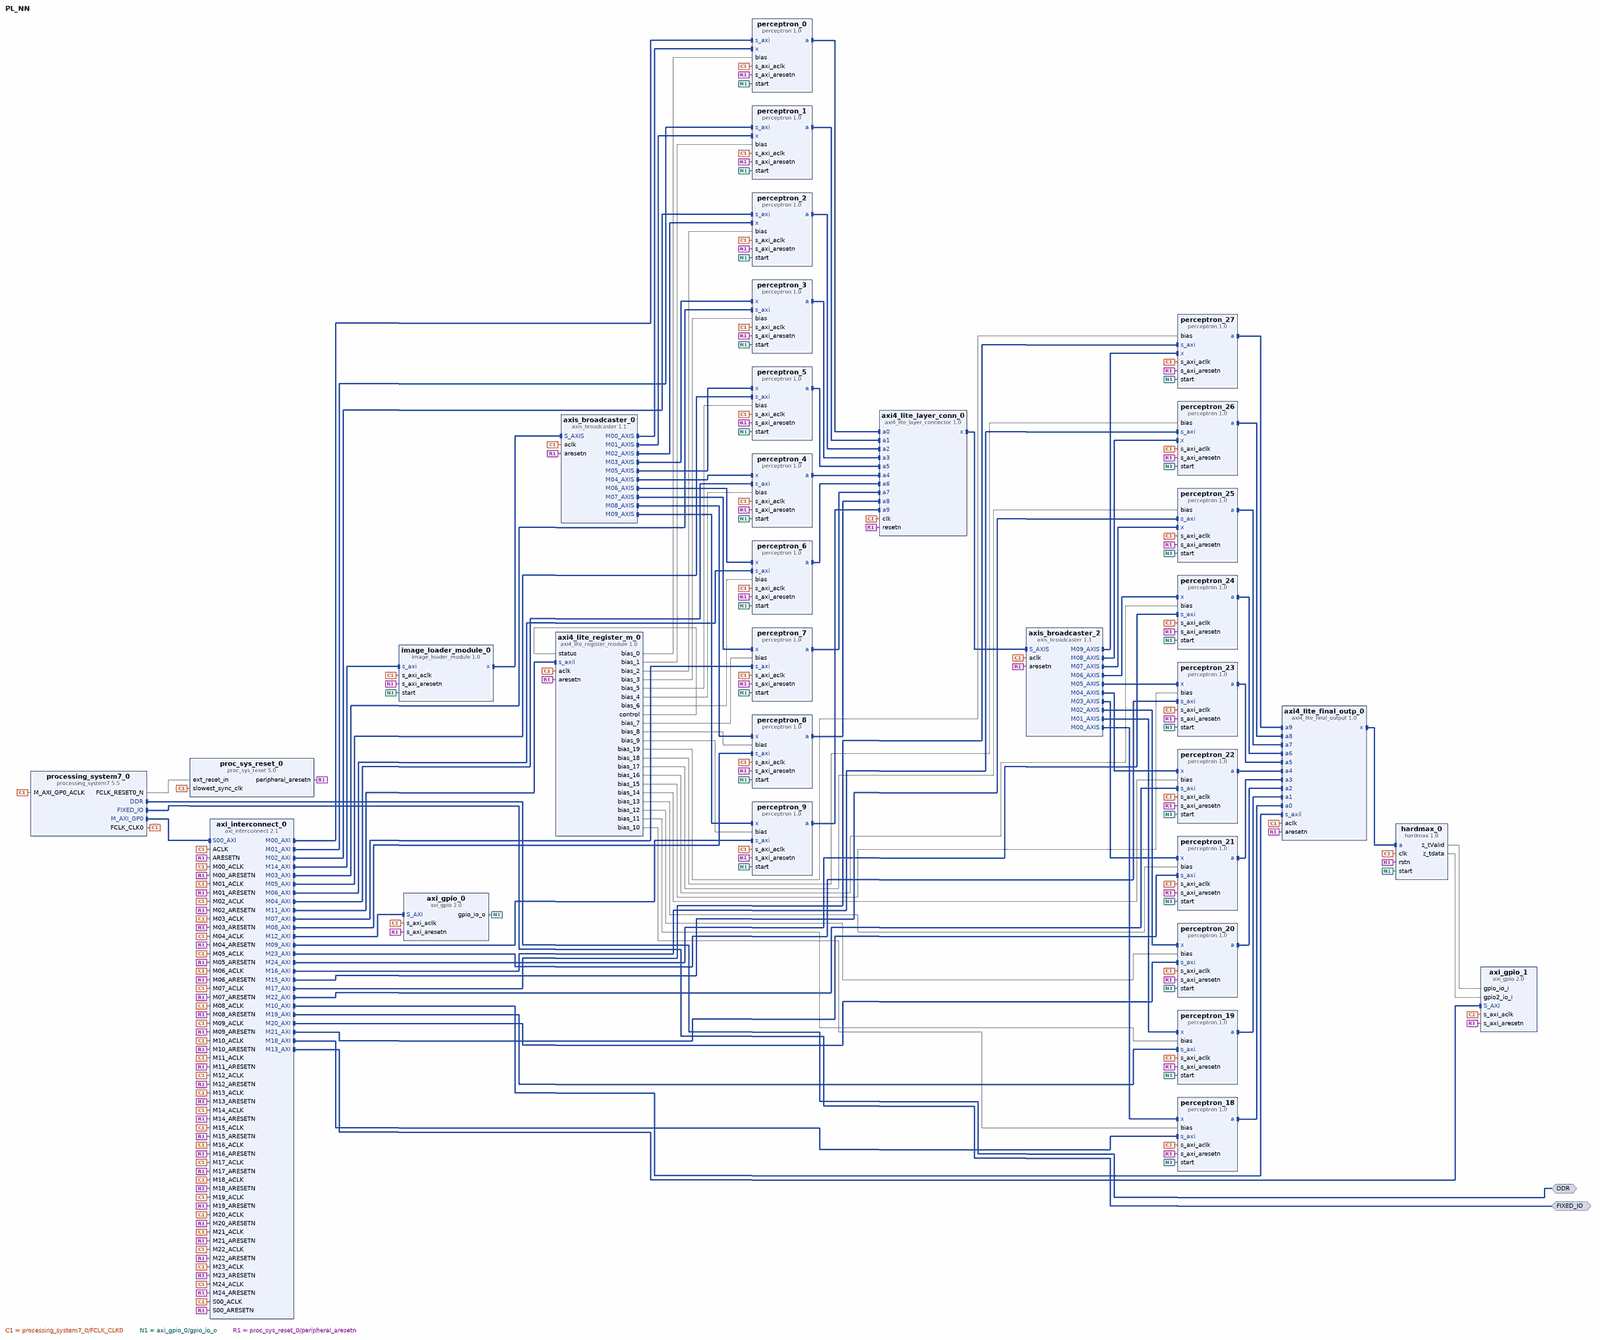
[diagram p0: block diagram of the top level, whole]
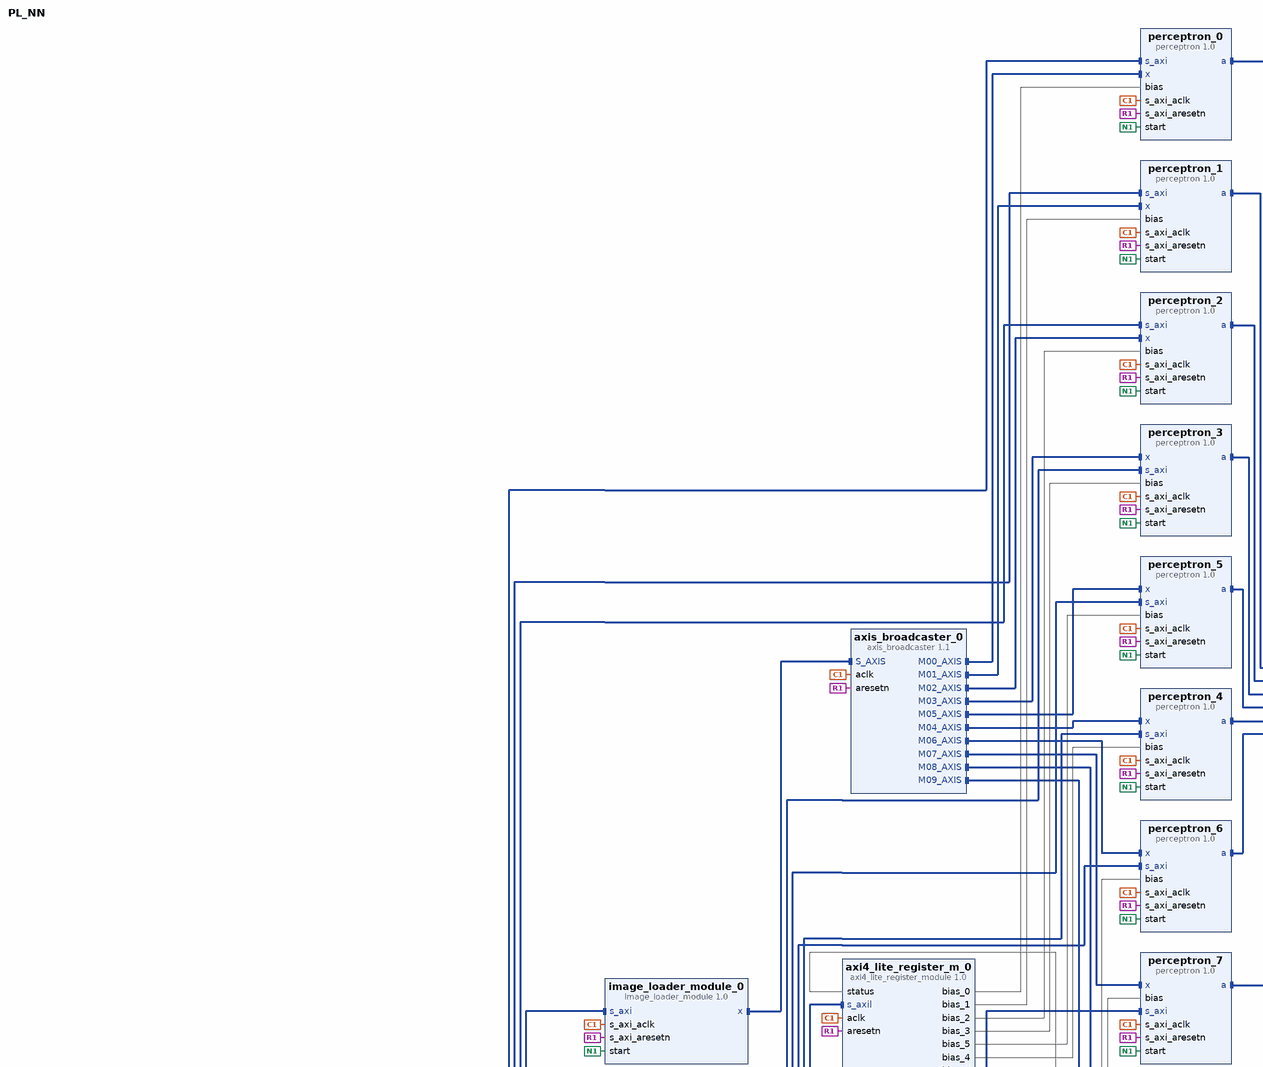
[diagram p1: block diagram of the top level, upper left part]
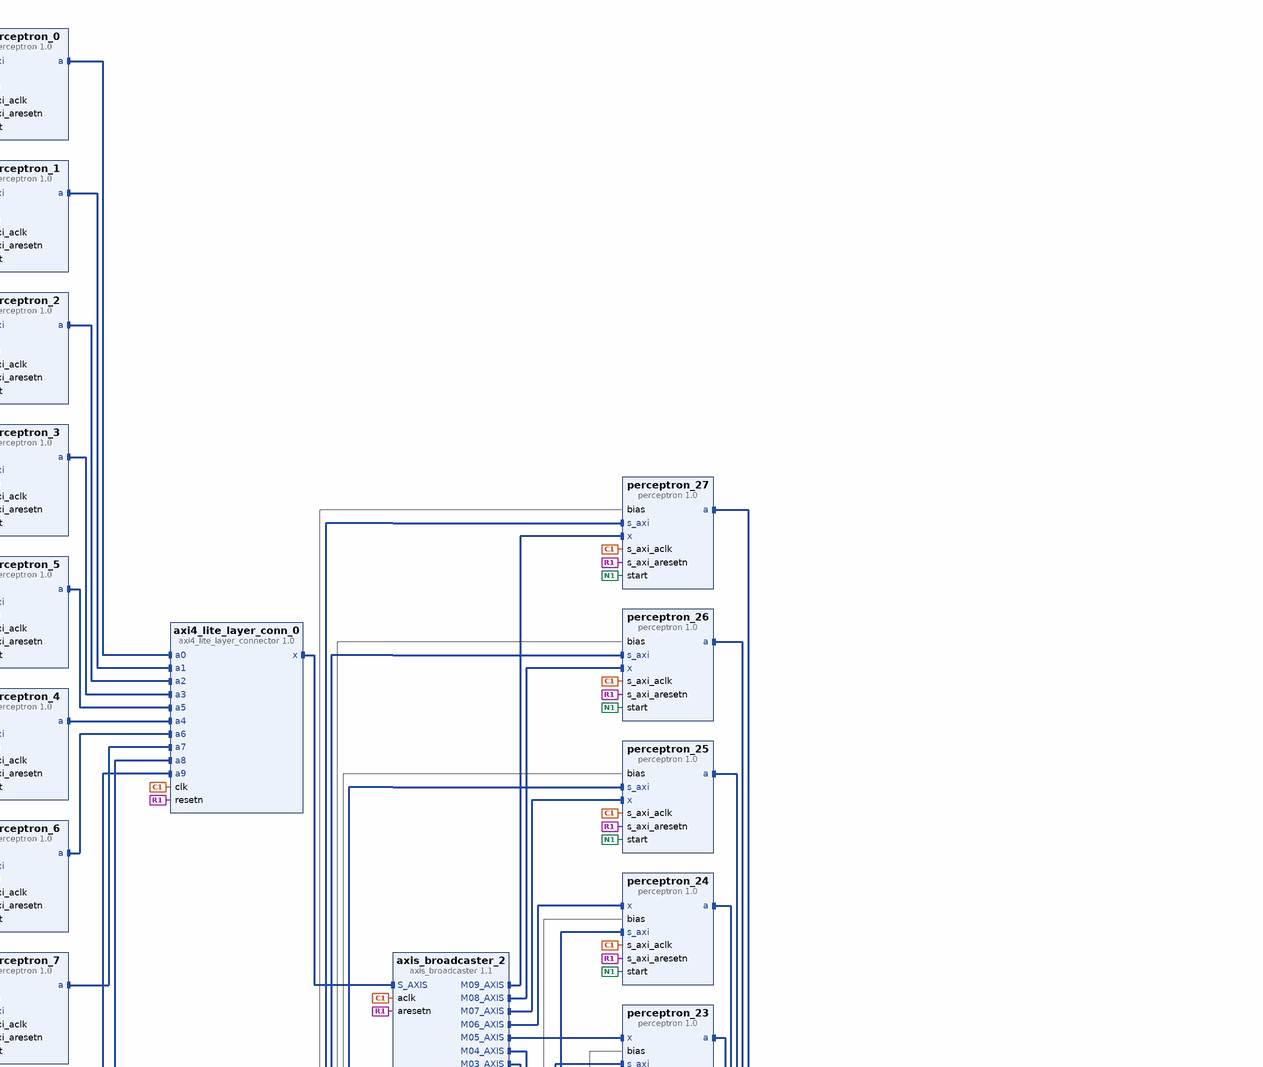
[diagram p2: block diagram of the top level, upper right part]
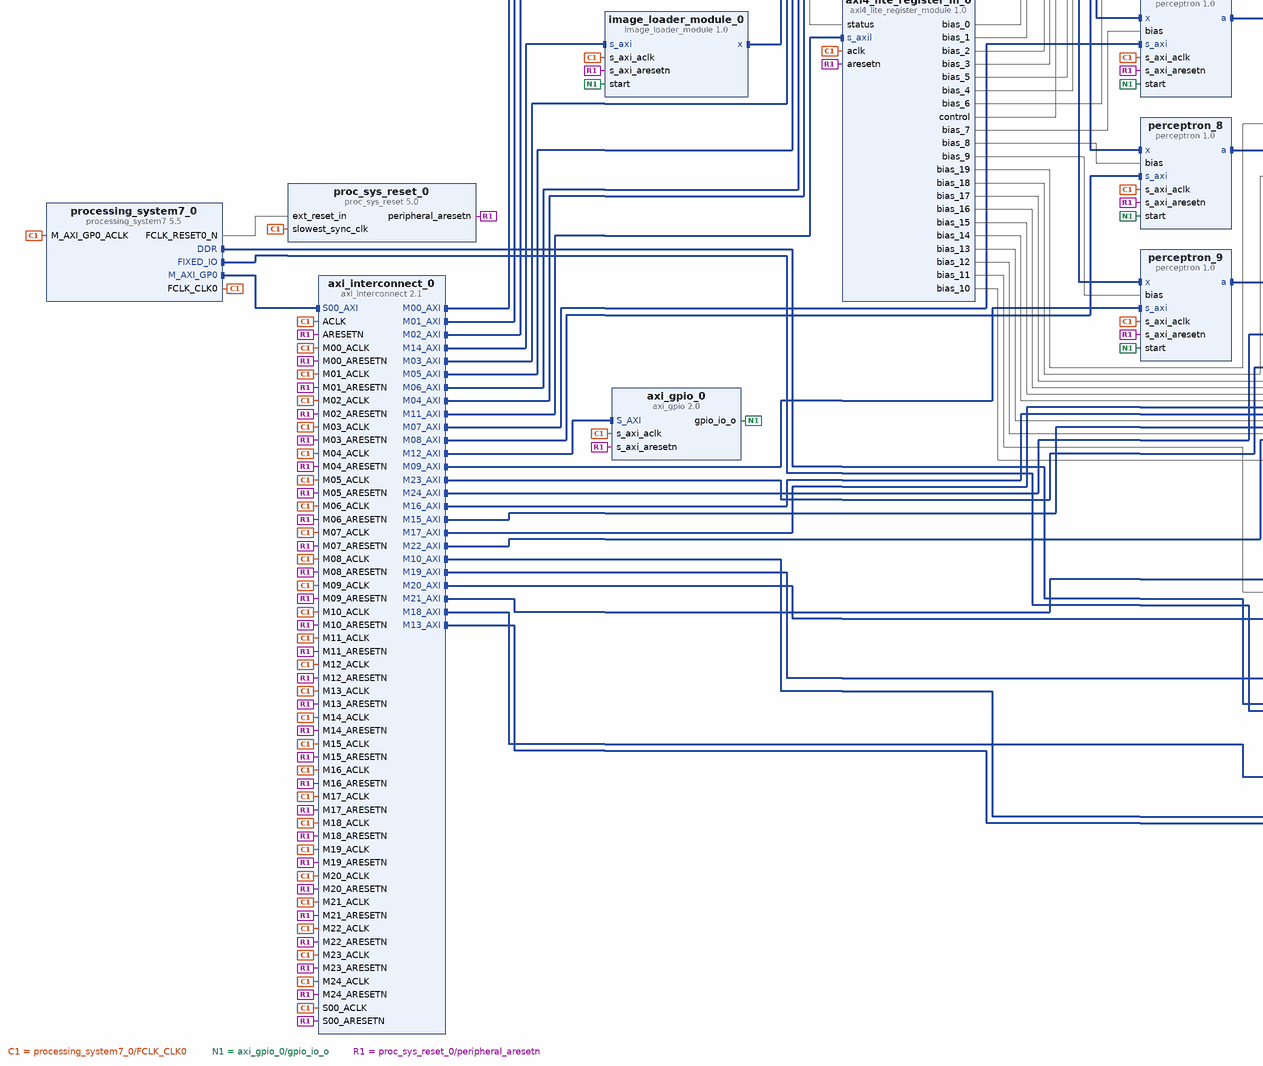
[diagram p3: block diagram of the top level, lower left part]
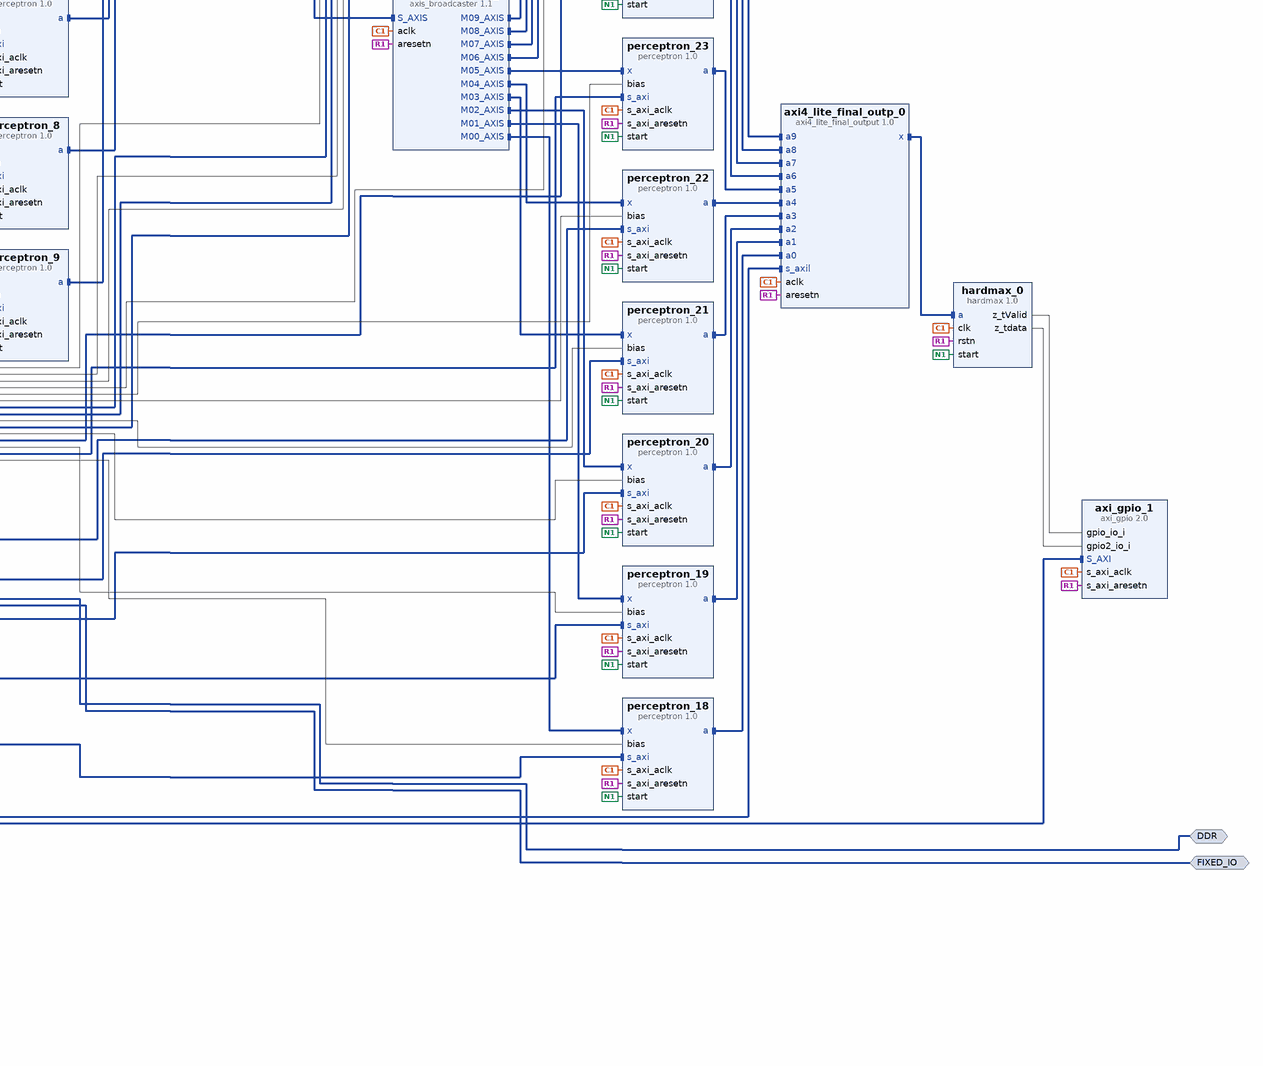
[diagram p4: block diagram of the top level, lower right part]
# Vivado block design PL_NN, xc7z010clg400-1, Vivado 2019.2
create_bd_design PL_NN

create_bd_intf_port -mode Master -vlnv xilinx.com:interface:ddrx_rtl:1.0 DDR
create_bd_intf_port -mode Master -vlnv xilinx.com:display_processing_system7:fixedio_rtl:1.0 FIXED_IO

create_bd_cell -type ip -vlnv xilinx.com:ip:processing_system7:5.5 processing_system7_0
set_property -dict [list \
  CONFIG.PCW_APU_PERIPHERAL_FREQMHZ 650 \
  CONFIG.PCW_CRYSTAL_PERIPHERAL_FREQMHZ 50.000000 \
  CONFIG.PCW_ENET0_ENET0_IO {MIO 16 .. 27} \
  CONFIG.PCW_ENET0_GRP_MDIO_ENABLE 1 \
  CONFIG.PCW_ENET0_GRP_MDIO_IO {MIO 52 .. 53} \
  CONFIG.PCW_ENET0_PERIPHERAL_ENABLE 1 \
  CONFIG.PCW_ENET0_RESET_ENABLE 0 \
  CONFIG.PCW_ENET_RESET_ENABLE 1 \
  CONFIG.PCW_ENET_RESET_SELECT {Share reset pin} \
  CONFIG.PCW_FPGA0_PERIPHERAL_FREQMHZ 75 \
  CONFIG.PCW_FPGA1_PERIPHERAL_FREQMHZ 50 \
  CONFIG.PCW_GP0_EN_MODIFIABLE_TXN 0 \
  CONFIG.PCW_GP1_EN_MODIFIABLE_TXN 0 \
  CONFIG.PCW_GPIO_MIO_GPIO_ENABLE 1 \
  CONFIG.PCW_GPIO_MIO_GPIO_IO MIO \
  CONFIG.PCW_I2C_RESET_ENABLE 1 \
  CONFIG.PCW_PERIPHERAL_BOARD_PRESET part0 \
  CONFIG.PCW_PRESET_BANK1_VOLTAGE {LVCMOS 1.8V} \
  CONFIG.PCW_QSPI_GRP_FBCLK_ENABLE 1 \
  CONFIG.PCW_QSPI_GRP_FBCLK_IO {MIO 8} \
  CONFIG.PCW_QSPI_GRP_SINGLE_SS_ENABLE 1 \
  CONFIG.PCW_QSPI_GRP_SINGLE_SS_IO {MIO 1 .. 6} \
  CONFIG.PCW_QSPI_PERIPHERAL_ENABLE 1 \
  CONFIG.PCW_QSPI_QSPI_IO {MIO 1 .. 6} \
  CONFIG.PCW_SD0_GRP_CD_ENABLE 1 \
  CONFIG.PCW_SD0_GRP_CD_IO {MIO 47} \
  CONFIG.PCW_SD0_GRP_WP_ENABLE 1 \
  CONFIG.PCW_SD0_GRP_WP_IO EMIO \
  CONFIG.PCW_SD0_PERIPHERAL_ENABLE 1 \
  CONFIG.PCW_SD0_SD0_IO {MIO 40 .. 45} \
  CONFIG.PCW_SDIO_PERIPHERAL_FREQMHZ 50 \
  CONFIG.PCW_SINGLE_QSPI_DATA_MODE x4 \
  CONFIG.PCW_TTC0_PERIPHERAL_ENABLE 1 \
  CONFIG.PCW_TTC0_TTC0_IO EMIO \
  CONFIG.PCW_UART1_PERIPHERAL_ENABLE 1 \
  CONFIG.PCW_UART1_UART1_IO {MIO 48 .. 49} \
  CONFIG.PCW_UART_PERIPHERAL_FREQMHZ 100 \
  CONFIG.PCW_UIPARAM_DDR_FREQ_MHZ 525 \
  CONFIG.PCW_UIPARAM_DDR_PARTNO {MT41K128M16 JT-125} \
  CONFIG.PCW_USB0_PERIPHERAL_ENABLE 1 \
  CONFIG.PCW_USB0_RESET_ENABLE 1 \
  CONFIG.PCW_USB0_RESET_IO {MIO 46} \
  CONFIG.PCW_USB0_USB0_IO {MIO 28 .. 39} \
  CONFIG.PCW_USB_RESET_ENABLE 1 \
  CONFIG.PCW_USB_RESET_SELECT {Share reset pin} \
] [get_bd_cells processing_system7_0]
# 503 more settings of processing_system7_0 are not shown: defaults, MIO pin electricals, DDR timing, and values the tool derives
create_bd_cell -type ip -vlnv xilinx.com:ip:proc_sys_reset:5.0 proc_sys_reset_0
create_bd_cell -type ip -vlnv xilinx.com:ip:axi_interconnect:2.1 axi_interconnect_0
set_property -dict {CONFIG.NUM_MI 25} [get_bd_cells axi_interconnect_0]
create_bd_cell -type ip -vlnv xilinx.com:user:image_loader_module:1.0 image_loader_module_0
create_bd_cell -type ip -vlnv xilinx.com:ip:axis_broadcaster:1.1 axis_broadcaster_0
set_property -dict [list \
  CONFIG.M02_TDATA_REMAP {tdata[31:0]} \
  CONFIG.M03_TDATA_REMAP {tdata[31:0]} \
  CONFIG.M04_TDATA_REMAP {tdata[31:0]} \
  CONFIG.M05_TDATA_REMAP {tdata[31:0]} \
  CONFIG.M06_TDATA_REMAP {tdata[31:0]} \
  CONFIG.M07_TDATA_REMAP {tdata[31:0]} \
  CONFIG.M08_TDATA_REMAP {tdata[31:0]} \
  CONFIG.M09_TDATA_REMAP {tdata[31:0]} \
  CONFIG.M10_TDATA_REMAP {tdata[31:0]} \
  CONFIG.M11_TDATA_REMAP {tdata[31:0]} \
  CONFIG.M12_TDATA_REMAP {tdata[31:0]} \
  CONFIG.M13_TDATA_REMAP {tdata[31:0]} \
  CONFIG.M14_TDATA_REMAP {tdata[31:0]} \
  CONFIG.M15_TDATA_REMAP {tdata[31:0]} \
  CONFIG.NUM_MI 10 \
] [get_bd_cells axis_broadcaster_0]
create_bd_cell -type ip -vlnv xilinx.com:ip:axi_gpio:2.0 axi_gpio_0
set_property -dict {CONFIG.C_ALL_OUTPUTS 1 CONFIG.C_GPIO_WIDTH 1} [get_bd_cells axi_gpio_0]
create_bd_cell -type ip -vlnv xilinx.com:ip:axi_gpio:2.0 axi_gpio_1
set_property -dict [list \
  CONFIG.C_ALL_INPUTS 1 \
  CONFIG.C_ALL_INPUTS_2 1 \
  CONFIG.C_GPIO2_WIDTH 4 \
  CONFIG.C_GPIO_WIDTH 1 \
  CONFIG.C_IS_DUAL 1 \
] [get_bd_cells axi_gpio_1]
create_bd_cell -type ip -vlnv xilinx.com:ip:axis_broadcaster:1.1 axis_broadcaster_2
set_property -dict [list \
  CONFIG.M02_TDATA_REMAP {tdata[31:0]} \
  CONFIG.M03_TDATA_REMAP {tdata[31:0]} \
  CONFIG.M04_TDATA_REMAP {tdata[31:0]} \
  CONFIG.M05_TDATA_REMAP {tdata[31:0]} \
  CONFIG.M06_TDATA_REMAP {tdata[31:0]} \
  CONFIG.M07_TDATA_REMAP {tdata[31:0]} \
  CONFIG.M08_TDATA_REMAP {tdata[31:0]} \
  CONFIG.M09_TDATA_REMAP {tdata[31:0]} \
  CONFIG.NUM_MI 10 \
] [get_bd_cells axis_broadcaster_2]
create_bd_cell -type ip -vlnv xilinx.com:user:axi4_lite_register_module:1.0 axi4_lite_register_m_0
create_bd_cell -type ip -vlnv xilinx.com:user:axi4_lite_final_output:1.0 axi4_lite_final_outp_0
create_bd_cell -type ip -vlnv xilinx.com:user:axi4_lite_layer_connector:1.0 axi4_lite_layer_conn_0
create_bd_cell -type ip -vlnv xilinx.com:user:hardmax:1.0 hardmax_0
create_bd_cell -type ip -vlnv xilinx.com:user:perceptron:1.0 perceptron_0
create_bd_cell -type ip -vlnv xilinx.com:user:perceptron:1.0 perceptron_1
create_bd_cell -type ip -vlnv xilinx.com:user:perceptron:1.0 perceptron_18
set_property -dict {CONFIG.input_size 10} [get_bd_cells perceptron_18]
create_bd_cell -type ip -vlnv xilinx.com:user:perceptron:1.0 perceptron_2
create_bd_cell -type ip -vlnv xilinx.com:user:perceptron:1.0 perceptron_3
create_bd_cell -type ip -vlnv xilinx.com:user:perceptron:1.0 perceptron_4
create_bd_cell -type ip -vlnv xilinx.com:user:perceptron:1.0 perceptron_5
create_bd_cell -type ip -vlnv xilinx.com:user:perceptron:1.0 perceptron_6
create_bd_cell -type ip -vlnv xilinx.com:user:perceptron:1.0 perceptron_7
create_bd_cell -type ip -vlnv xilinx.com:user:perceptron:1.0 perceptron_8
create_bd_cell -type ip -vlnv xilinx.com:user:perceptron:1.0 perceptron_9
create_bd_cell -type ip -vlnv xilinx.com:user:perceptron:1.0 perceptron_19
set_property -dict {CONFIG.input_size 10} [get_bd_cells perceptron_19]
create_bd_cell -type ip -vlnv xilinx.com:user:perceptron:1.0 perceptron_20
set_property -dict {CONFIG.input_size 10} [get_bd_cells perceptron_20]
create_bd_cell -type ip -vlnv xilinx.com:user:perceptron:1.0 perceptron_21
set_property -dict {CONFIG.input_size 10} [get_bd_cells perceptron_21]
create_bd_cell -type ip -vlnv xilinx.com:user:perceptron:1.0 perceptron_22
set_property -dict {CONFIG.input_size 10} [get_bd_cells perceptron_22]
create_bd_cell -type ip -vlnv xilinx.com:user:perceptron:1.0 perceptron_23
set_property -dict {CONFIG.input_size 10} [get_bd_cells perceptron_23]
create_bd_cell -type ip -vlnv xilinx.com:user:perceptron:1.0 perceptron_24
set_property -dict {CONFIG.input_size 10} [get_bd_cells perceptron_24]
create_bd_cell -type ip -vlnv xilinx.com:user:perceptron:1.0 perceptron_25
set_property -dict {CONFIG.input_size 10} [get_bd_cells perceptron_25]
create_bd_cell -type ip -vlnv xilinx.com:user:perceptron:1.0 perceptron_26
set_property -dict {CONFIG.input_size 10} [get_bd_cells perceptron_26]
create_bd_cell -type ip -vlnv xilinx.com:user:perceptron:1.0 perceptron_27
set_property -dict {CONFIG.input_size 10} [get_bd_cells perceptron_27]

# ---- connections ----

connect_bd_intf_net [get_bd_intf_pins perceptron_0/a] [get_bd_intf_pins axi4_lite_layer_conn_0/a0]
connect_bd_intf_net [get_bd_intf_pins perceptron_9/a] [get_bd_intf_pins axi4_lite_layer_conn_0/a9]
connect_bd_intf_net [get_bd_intf_pins perceptron_24/a] [get_bd_intf_pins axi4_lite_final_outp_0/a6]
connect_bd_intf_net [get_bd_intf_pins perceptron_1/a] [get_bd_intf_pins axi4_lite_layer_conn_0/a1]
connect_bd_intf_net [get_bd_intf_pins perceptron_7/a] [get_bd_intf_pins axi4_lite_layer_conn_0/a7]
connect_bd_intf_net [get_bd_intf_pins perceptron_19/a] [get_bd_intf_pins axi4_lite_final_outp_0/a1]
connect_bd_intf_net [get_bd_intf_pins perceptron_22/a] [get_bd_intf_pins axi4_lite_final_outp_0/a4]
connect_bd_intf_net [get_bd_intf_pins perceptron_27/a] [get_bd_intf_pins axi4_lite_final_outp_0/a9]
connect_bd_intf_net [get_bd_intf_pins axi4_lite_final_outp_0/x] [get_bd_intf_pins hardmax_0/a]
connect_bd_intf_net [get_bd_intf_pins perceptron_2/a] [get_bd_intf_pins axi4_lite_layer_conn_0/a2]
connect_bd_intf_net [get_bd_intf_pins perceptron_5/a] [get_bd_intf_pins axi4_lite_layer_conn_0/a5]
connect_bd_intf_net [get_bd_intf_pins perceptron_4/a] [get_bd_intf_pins axi4_lite_layer_conn_0/a4]
connect_bd_intf_net [get_bd_intf_pins perceptron_8/a] [get_bd_intf_pins axi4_lite_layer_conn_0/a8]
connect_bd_intf_net [get_bd_intf_pins perceptron_3/a] [get_bd_intf_pins axi4_lite_layer_conn_0/a3]
connect_bd_intf_net [get_bd_intf_pins axi4_lite_layer_conn_0/x] [get_bd_intf_pins axis_broadcaster_2/S_AXIS]
connect_bd_intf_net [get_bd_intf_pins perceptron_21/a] [get_bd_intf_pins axi4_lite_final_outp_0/a3]
connect_bd_intf_net [get_bd_intf_pins perceptron_25/a] [get_bd_intf_pins axi4_lite_final_outp_0/a7]
connect_bd_intf_net [get_bd_intf_pins perceptron_23/a] [get_bd_intf_pins axi4_lite_final_outp_0/a5]
connect_bd_intf_net [get_bd_intf_pins perceptron_26/a] [get_bd_intf_pins axi4_lite_final_outp_0/a8]
connect_bd_intf_net [get_bd_intf_pins perceptron_18/a] [get_bd_intf_pins axi4_lite_final_outp_0/a0]
connect_bd_intf_net [get_bd_intf_pins perceptron_20/a] [get_bd_intf_pins axi4_lite_final_outp_0/a2]
connect_bd_intf_net [get_bd_intf_pins axis_broadcaster_2/M02_AXIS] [get_bd_intf_pins perceptron_20/x]
connect_bd_intf_net [get_bd_intf_pins axis_broadcaster_2/M09_AXIS] [get_bd_intf_pins perceptron_27/x]
connect_bd_intf_net [get_bd_intf_pins axis_broadcaster_2/M06_AXIS] [get_bd_intf_pins perceptron_24/x]
connect_bd_intf_net [get_bd_intf_pins axis_broadcaster_2/M08_AXIS] [get_bd_intf_pins perceptron_26/x]
connect_bd_intf_net [get_bd_intf_pins axis_broadcaster_2/M01_AXIS] [get_bd_intf_pins perceptron_19/x]
connect_bd_intf_net [get_bd_intf_pins axis_broadcaster_2/M03_AXIS] [get_bd_intf_pins perceptron_21/x]
connect_bd_intf_net [get_bd_intf_pins axis_broadcaster_2/M00_AXIS] [get_bd_intf_pins perceptron_18/x]
connect_bd_intf_net [get_bd_intf_ports DDR] [get_bd_intf_pins processing_system7_0/DDR]
connect_bd_intf_net [get_bd_intf_ports FIXED_IO] [get_bd_intf_pins processing_system7_0/FIXED_IO]
connect_bd_intf_net [get_bd_intf_pins axis_broadcaster_2/M05_AXIS] [get_bd_intf_pins perceptron_23/x]
connect_bd_intf_net [get_bd_intf_pins axis_broadcaster_2/M07_AXIS] [get_bd_intf_pins perceptron_25/x]
connect_bd_intf_net [get_bd_intf_pins axis_broadcaster_2/M04_AXIS] [get_bd_intf_pins perceptron_22/x]
connect_bd_intf_net [get_bd_intf_pins axi_interconnect_0/M23_AXI] [get_bd_intf_pins perceptron_23/s_axi]
connect_bd_intf_net [get_bd_intf_pins axi_interconnect_0/M07_AXI] [get_bd_intf_pins perceptron_7/s_axi]
connect_bd_intf_net [get_bd_intf_pins axi_interconnect_0/M10_AXI] [get_bd_intf_pins axi4_lite_final_outp_0/s_axil]
connect_bd_intf_net [get_bd_intf_pins axi_interconnect_0/M24_AXI] [get_bd_intf_pins perceptron_24/s_axi]
connect_bd_intf_net [get_bd_intf_pins axi_interconnect_0/M06_AXI] [get_bd_intf_pins perceptron_6/s_axi]
connect_bd_intf_net [get_bd_intf_pins axi_interconnect_0/M05_AXI] [get_bd_intf_pins perceptron_5/s_axi]
connect_bd_intf_net [get_bd_intf_pins axi_interconnect_0/M02_AXI] [get_bd_intf_pins perceptron_2/s_axi]
connect_bd_intf_net [get_bd_intf_pins axis_broadcaster_0/M08_AXIS] [get_bd_intf_pins perceptron_8/x]
connect_bd_intf_net [get_bd_intf_pins axis_broadcaster_0/M00_AXIS] [get_bd_intf_pins perceptron_0/x]
connect_bd_intf_net [get_bd_intf_pins axis_broadcaster_0/M04_AXIS] [get_bd_intf_pins perceptron_4/x]
connect_bd_intf_net [get_bd_intf_pins axi_interconnect_0/M16_AXI] [get_bd_intf_pins perceptron_26/s_axi]
connect_bd_intf_net [get_bd_intf_pins axi_interconnect_0/M03_AXI] [get_bd_intf_pins perceptron_3/s_axi]
connect_bd_intf_net [get_bd_intf_pins axi_interconnect_0/M12_AXI] [get_bd_intf_pins axi_gpio_0/S_AXI]
connect_bd_intf_net [get_bd_intf_pins axis_broadcaster_0/M09_AXIS] [get_bd_intf_pins perceptron_9/x]
connect_bd_intf_net [get_bd_intf_pins axi_interconnect_0/M18_AXI] [get_bd_intf_pins perceptron_18/s_axi]
connect_bd_intf_net [get_bd_intf_pins axi_interconnect_0/M22_AXI] [get_bd_intf_pins perceptron_22/s_axi]
connect_bd_intf_net [get_bd_intf_pins axis_broadcaster_0/M01_AXIS] [get_bd_intf_pins perceptron_1/x]
connect_bd_intf_net [get_bd_intf_pins axi_interconnect_0/M08_AXI] [get_bd_intf_pins perceptron_8/s_axi]
connect_bd_intf_net [get_bd_intf_pins axis_broadcaster_0/M03_AXIS] [get_bd_intf_pins perceptron_3/x]
connect_bd_intf_net [get_bd_intf_pins axi_interconnect_0/M01_AXI] [get_bd_intf_pins perceptron_1/s_axi]
connect_bd_intf_net [get_bd_intf_pins axi_interconnect_0/M09_AXI] [get_bd_intf_pins perceptron_9/s_axi]
connect_bd_intf_net [get_bd_intf_pins axis_broadcaster_0/M05_AXIS] [get_bd_intf_pins perceptron_5/x]
connect_bd_intf_net [get_bd_intf_pins axi_interconnect_0/M13_AXI] [get_bd_intf_pins axi_gpio_1/S_AXI]
connect_bd_intf_net [get_bd_intf_pins axi_interconnect_0/M19_AXI] [get_bd_intf_pins perceptron_19/s_axi]
connect_bd_intf_net [get_bd_intf_pins axis_broadcaster_0/M07_AXIS] [get_bd_intf_pins perceptron_7/x]
connect_bd_intf_net [get_bd_intf_pins axis_broadcaster_0/M02_AXIS] [get_bd_intf_pins perceptron_2/x]
connect_bd_intf_net [get_bd_intf_pins axi_interconnect_0/M15_AXI] [get_bd_intf_pins perceptron_25/s_axi]
connect_bd_intf_net [get_bd_intf_pins axi_interconnect_0/M20_AXI] [get_bd_intf_pins perceptron_20/s_axi]
connect_bd_intf_net [get_bd_intf_pins axi_interconnect_0/M00_AXI] [get_bd_intf_pins perceptron_0/s_axi]
connect_bd_intf_net [get_bd_intf_pins axi_interconnect_0/M17_AXI] [get_bd_intf_pins perceptron_27/s_axi]
connect_bd_intf_net [get_bd_intf_pins processing_system7_0/M_AXI_GP0] [get_bd_intf_pins axi_interconnect_0/S00_AXI]
connect_bd_intf_net [get_bd_intf_pins image_loader_module_0/x] [get_bd_intf_pins axis_broadcaster_0/S_AXIS]
connect_bd_intf_net [get_bd_intf_pins axi_interconnect_0/M14_AXI] [get_bd_intf_pins image_loader_module_0/s_axi]
connect_bd_intf_net [get_bd_intf_pins axi_interconnect_0/M04_AXI] [get_bd_intf_pins perceptron_4/s_axi]
connect_bd_intf_net [get_bd_intf_pins axi_interconnect_0/M21_AXI] [get_bd_intf_pins perceptron_21/s_axi]
connect_bd_intf_net [get_bd_intf_pins axis_broadcaster_0/M06_AXIS] [get_bd_intf_pins perceptron_6/x]
connect_bd_intf_net [get_bd_intf_pins axi_interconnect_0/M11_AXI] [get_bd_intf_pins axi4_lite_register_m_0/s_axil]
connect_bd_intf_net [get_bd_intf_pins perceptron_6/a] [get_bd_intf_pins axi4_lite_layer_conn_0/a6]
connect_bd_net [get_bd_pins processing_system7_0/FCLK_CLK0] \
  [get_bd_pins proc_sys_reset_0/slowest_sync_clk] [get_bd_pins processing_system7_0/M_AXI_GP0_ACLK] \
  [get_bd_pins image_loader_module_0/s_axi_aclk] [get_bd_pins axi_gpio_0/s_axi_aclk] [get_bd_pins axi_gpio_1/s_axi_aclk] \
  [get_bd_pins axi_interconnect_0/ACLK] [get_bd_pins axi_interconnect_0/M00_ACLK] [get_bd_pins axi_interconnect_0/M01_ACLK] \
  [get_bd_pins axi_interconnect_0/M02_ACLK] [get_bd_pins axi_interconnect_0/M03_ACLK] \
  [get_bd_pins axi_interconnect_0/M04_ACLK] [get_bd_pins axi_interconnect_0/M05_ACLK] \
  [get_bd_pins axi_interconnect_0/M06_ACLK] [get_bd_pins axi_interconnect_0/M07_ACLK] \
  [get_bd_pins axi_interconnect_0/M08_ACLK] [get_bd_pins axi_interconnect_0/M09_ACLK] \
  [get_bd_pins axi_interconnect_0/M10_ACLK] [get_bd_pins axi_interconnect_0/M11_ACLK] \
  [get_bd_pins axi_interconnect_0/M12_ACLK] [get_bd_pins axi_interconnect_0/M13_ACLK] \
  [get_bd_pins axi_interconnect_0/M14_ACLK] [get_bd_pins axi_interconnect_0/M15_ACLK] \
  [get_bd_pins axi_interconnect_0/M16_ACLK] [get_bd_pins axi_interconnect_0/M17_ACLK] \
  [get_bd_pins axi_interconnect_0/M18_ACLK] [get_bd_pins axi_interconnect_0/M19_ACLK] \
  [get_bd_pins axi_interconnect_0/M20_ACLK] [get_bd_pins axi_interconnect_0/M21_ACLK] [get_bd_pins axis_broadcaster_0/aclk] \
  [get_bd_pins axi_interconnect_0/M24_ACLK] [get_bd_pins axi_interconnect_0/M23_ACLK] \
  [get_bd_pins axi_interconnect_0/M22_ACLK] [get_bd_pins axi_interconnect_0/S00_ACLK] [get_bd_pins axis_broadcaster_2/aclk] \
  [get_bd_pins axi4_lite_register_m_0/aclk] [get_bd_pins axi4_lite_final_outp_0/aclk] \
  [get_bd_pins axi4_lite_layer_conn_0/clk] [get_bd_pins hardmax_0/clk] [get_bd_pins perceptron_0/s_axi_aclk] \
  [get_bd_pins perceptron_1/s_axi_aclk] [get_bd_pins perceptron_18/s_axi_aclk] [get_bd_pins perceptron_2/s_axi_aclk] \
  [get_bd_pins perceptron_3/s_axi_aclk] [get_bd_pins perceptron_4/s_axi_aclk] [get_bd_pins perceptron_5/s_axi_aclk] \
  [get_bd_pins perceptron_6/s_axi_aclk] [get_bd_pins perceptron_7/s_axi_aclk] [get_bd_pins perceptron_8/s_axi_aclk] \
  [get_bd_pins perceptron_9/s_axi_aclk] [get_bd_pins perceptron_19/s_axi_aclk] [get_bd_pins perceptron_20/s_axi_aclk] \
  [get_bd_pins perceptron_21/s_axi_aclk] [get_bd_pins perceptron_22/s_axi_aclk] [get_bd_pins perceptron_23/s_axi_aclk] \
  [get_bd_pins perceptron_24/s_axi_aclk] [get_bd_pins perceptron_25/s_axi_aclk] [get_bd_pins perceptron_26/s_axi_aclk] \
  [get_bd_pins perceptron_27/s_axi_aclk]
connect_bd_net [get_bd_pins axi4_lite_register_m_0/bias_0] [get_bd_pins perceptron_0/bias]
connect_bd_net [get_bd_pins axi4_lite_register_m_0/bias_1] [get_bd_pins perceptron_1/bias]
connect_bd_net [get_bd_pins axi4_lite_register_m_0/bias_2] [get_bd_pins perceptron_2/bias]
connect_bd_net [get_bd_pins axi4_lite_register_m_0/bias_3] [get_bd_pins perceptron_3/bias]
connect_bd_net [get_bd_pins axi4_lite_register_m_0/bias_4] [get_bd_pins perceptron_4/bias]
connect_bd_net [get_bd_pins axi4_lite_register_m_0/bias_5] [get_bd_pins perceptron_5/bias]
connect_bd_net [get_bd_pins axi4_lite_register_m_0/bias_6] [get_bd_pins perceptron_6/bias]
connect_bd_net [get_bd_pins axi4_lite_register_m_0/bias_7] [get_bd_pins perceptron_7/bias]
connect_bd_net [get_bd_pins axi4_lite_register_m_0/bias_8] [get_bd_pins perceptron_8/bias]
connect_bd_net [get_bd_pins axi4_lite_register_m_0/bias_9] [get_bd_pins perceptron_9/bias]
connect_bd_net [get_bd_pins axi4_lite_register_m_0/bias_12] [get_bd_pins perceptron_20/bias]
connect_bd_net [get_bd_pins axi4_lite_register_m_0/bias_13] [get_bd_pins perceptron_21/bias]
connect_bd_net [get_bd_pins axi4_lite_register_m_0/bias_15] [get_bd_pins perceptron_23/bias]
connect_bd_net [get_bd_pins axi4_lite_register_m_0/bias_16] [get_bd_pins perceptron_24/bias]
connect_bd_net [get_bd_pins axi4_lite_register_m_0/bias_18] [get_bd_pins perceptron_26/bias]
connect_bd_net [get_bd_pins axi4_lite_register_m_0/bias_19] [get_bd_pins perceptron_27/bias]
connect_bd_net [get_bd_pins axi4_lite_register_m_0/control] [get_bd_pins axi4_lite_register_m_0/status]
connect_bd_net [get_bd_pins axi_gpio_0/gpio_io_o] \
  [get_bd_pins image_loader_module_0/start] [get_bd_pins perceptron_0/start] [get_bd_pins perceptron_1/start] \
  [get_bd_pins perceptron_18/start] [get_bd_pins perceptron_2/start] [get_bd_pins perceptron_3/start] \
  [get_bd_pins perceptron_4/start] [get_bd_pins perceptron_5/start] [get_bd_pins perceptron_6/start] \
  [get_bd_pins perceptron_7/start] [get_bd_pins perceptron_8/start] [get_bd_pins perceptron_9/start] \
  [get_bd_pins perceptron_19/start] [get_bd_pins perceptron_20/start] [get_bd_pins perceptron_21/start] \
  [get_bd_pins perceptron_22/start] [get_bd_pins perceptron_23/start] [get_bd_pins perceptron_24/start] \
  [get_bd_pins perceptron_25/start] [get_bd_pins perceptron_26/start] [get_bd_pins perceptron_27/start] \
  [get_bd_pins hardmax_0/start]
connect_bd_net [get_bd_pins hardmax_0/z_tValid] [get_bd_pins axi_gpio_1/gpio_io_i]
connect_bd_net [get_bd_pins hardmax_0/z_tdata] [get_bd_pins axi_gpio_1/gpio2_io_i]
connect_bd_net [get_bd_pins proc_sys_reset_0/peripheral_aresetn] \
  [get_bd_pins axi_gpio_1/s_axi_aresetn] [get_bd_pins axi_interconnect_0/ARESETN] \
  [get_bd_pins axi_interconnect_0/M00_ARESETN] [get_bd_pins axi_interconnect_0/M01_ARESETN] \
  [get_bd_pins axi_interconnect_0/M02_ARESETN] [get_bd_pins axi_interconnect_0/M03_ARESETN] \
  [get_bd_pins axi_interconnect_0/M04_ARESETN] [get_bd_pins axi_interconnect_0/M05_ARESETN] \
  [get_bd_pins axi_interconnect_0/M06_ARESETN] [get_bd_pins axi_interconnect_0/M07_ARESETN] \
  [get_bd_pins axi_interconnect_0/M08_ARESETN] [get_bd_pins axi_interconnect_0/M09_ARESETN] \
  [get_bd_pins axi_interconnect_0/M10_ARESETN] [get_bd_pins axi_interconnect_0/M11_ARESETN] \
  [get_bd_pins axi_interconnect_0/M12_ARESETN] [get_bd_pins axi_interconnect_0/M13_ARESETN] \
  [get_bd_pins axi_interconnect_0/M14_ARESETN] [get_bd_pins axi_interconnect_0/M15_ARESETN] \
  [get_bd_pins axi_interconnect_0/M16_ARESETN] [get_bd_pins axi_interconnect_0/M17_ARESETN] \
  [get_bd_pins axi_interconnect_0/M18_ARESETN] [get_bd_pins axi_interconnect_0/M19_ARESETN] \
  [get_bd_pins axi_interconnect_0/M20_ARESETN] [get_bd_pins axi_interconnect_0/M21_ARESETN] \
  [get_bd_pins axis_broadcaster_0/aresetn] [get_bd_pins axi_interconnect_0/M22_ARESETN] \
  [get_bd_pins axi_interconnect_0/M23_ARESETN] [get_bd_pins axi_interconnect_0/M24_ARESETN] \
  [get_bd_pins image_loader_module_0/s_axi_aresetn] [get_bd_pins axi_gpio_0/s_axi_aresetn] \
  [get_bd_pins axi_interconnect_0/S00_ARESETN] [get_bd_pins axis_broadcaster_2/aresetn] \
  [get_bd_pins axi4_lite_register_m_0/aresetn] [get_bd_pins axi4_lite_final_outp_0/aresetn] \
  [get_bd_pins axi4_lite_layer_conn_0/resetn] [get_bd_pins hardmax_0/rstn] [get_bd_pins perceptron_0/s_axi_aresetn] \
  [get_bd_pins perceptron_1/s_axi_aresetn] [get_bd_pins perceptron_18/s_axi_aresetn] [get_bd_pins perceptron_2/s_axi_aresetn] \
  [get_bd_pins perceptron_3/s_axi_aresetn] [get_bd_pins perceptron_4/s_axi_aresetn] [get_bd_pins perceptron_5/s_axi_aresetn] \
  [get_bd_pins perceptron_6/s_axi_aresetn] [get_bd_pins perceptron_7/s_axi_aresetn] [get_bd_pins perceptron_8/s_axi_aresetn] \
  [get_bd_pins perceptron_9/s_axi_aresetn] [get_bd_pins perceptron_19/s_axi_aresetn] \
  [get_bd_pins perceptron_20/s_axi_aresetn] [get_bd_pins perceptron_21/s_axi_aresetn] \
  [get_bd_pins perceptron_22/s_axi_aresetn] [get_bd_pins perceptron_23/s_axi_aresetn] \
  [get_bd_pins perceptron_24/s_axi_aresetn] [get_bd_pins perceptron_25/s_axi_aresetn] \
  [get_bd_pins perceptron_26/s_axi_aresetn] [get_bd_pins perceptron_27/s_axi_aresetn]
connect_bd_net [get_bd_pins processing_system7_0/FCLK_RESET0_N] [get_bd_pins proc_sys_reset_0/ext_reset_in]
connect_bd_net [get_bd_pins axi4_lite_register_m_0/bias_14] [get_bd_pins perceptron_22/bias]
connect_bd_net [get_bd_pins axi4_lite_register_m_0/bias_17] [get_bd_pins perceptron_25/bias]
connect_bd_net [get_bd_pins axi4_lite_register_m_0/bias_10] [get_bd_pins perceptron_18/bias]
connect_bd_net [get_bd_pins axi4_lite_register_m_0/bias_11] [get_bd_pins perceptron_19/bias]

# ---- address map ----
assign_bd_address -offset 0x41200000 -range 64K -target_address_space [get_bd_addr_spaces processing_system7_0/Data] [get_bd_addr_segs axi_gpio_0/S_AXI/Reg]
assign_bd_address -offset 0x41210000 -range 64K -target_address_space [get_bd_addr_spaces processing_system7_0/Data] [get_bd_addr_segs axi_gpio_1/S_AXI/Reg]
assign_bd_address -offset 0x43B00000 -range 4K -target_address_space [get_bd_addr_spaces processing_system7_0/Data] [get_bd_addr_segs perceptron_0/s_axi/reg0]
assign_bd_address -offset 0x43B10000 -range 4K -target_address_space [get_bd_addr_spaces processing_system7_0/Data] [get_bd_addr_segs perceptron_23/s_axi/reg0]
assign_bd_address -offset 0x43B20000 -range 64K -target_address_space [get_bd_addr_spaces processing_system7_0/Data] [get_bd_addr_segs perceptron_24/s_axi/reg0]
assign_bd_address -offset 0x43C00000 -range 4K -target_address_space [get_bd_addr_spaces processing_system7_0/Data] [get_bd_addr_segs perceptron_1/s_axi/reg0]
assign_bd_address -offset 0x43C10000 -range 4K -target_address_space [get_bd_addr_spaces processing_system7_0/Data] [get_bd_addr_segs perceptron_2/s_axi/reg0]
assign_bd_address -offset 0x43C20000 -range 4K -target_address_space [get_bd_addr_spaces processing_system7_0/Data] [get_bd_addr_segs perceptron_3/s_axi/reg0]
assign_bd_address -offset 0x43C30000 -range 4K -target_address_space [get_bd_addr_spaces processing_system7_0/Data] [get_bd_addr_segs perceptron_4/s_axi/reg0]
assign_bd_address -offset 0x43C40000 -range 4K -target_address_space [get_bd_addr_spaces processing_system7_0/Data] [get_bd_addr_segs perceptron_5/s_axi/reg0]
assign_bd_address -offset 0x43C50000 -range 4K -target_address_space [get_bd_addr_spaces processing_system7_0/Data] [get_bd_addr_segs perceptron_6/s_axi/reg0]
assign_bd_address -offset 0x43C60000 -range 4K -target_address_space [get_bd_addr_spaces processing_system7_0/Data] [get_bd_addr_segs perceptron_7/s_axi/reg0]
assign_bd_address -offset 0x43C70000 -range 4K -target_address_space [get_bd_addr_spaces processing_system7_0/Data] [get_bd_addr_segs perceptron_8/s_axi/reg0]
assign_bd_address -offset 0x43C80000 -range 4K -target_address_space [get_bd_addr_spaces processing_system7_0/Data] [get_bd_addr_segs perceptron_9/s_axi/reg0]
assign_bd_address -offset 0x43C90000 -range 64K -target_address_space [get_bd_addr_spaces processing_system7_0/Data] [get_bd_addr_segs axi4_lite_final_outp_0/s_axil/reg0]
assign_bd_address -offset 0x43CA0000 -range 64K -target_address_space [get_bd_addr_spaces processing_system7_0/Data] [get_bd_addr_segs image_loader_module_0/s_axi/reg0]
assign_bd_address -offset 0x43CB0000 -range 64K -target_address_space [get_bd_addr_spaces processing_system7_0/Data] [get_bd_addr_segs perceptron_25/s_axi/reg0]
assign_bd_address -offset 0x43CC0000 -range 64K -target_address_space [get_bd_addr_spaces processing_system7_0/Data] [get_bd_addr_segs perceptron_26/s_axi/reg0]
assign_bd_address -offset 0x43CD0000 -range 64K -target_address_space [get_bd_addr_spaces processing_system7_0/Data] [get_bd_addr_segs perceptron_27/s_axi/reg0]
assign_bd_address -offset 0x43D10000 -range 4K -target_address_space [get_bd_addr_spaces processing_system7_0/Data] [get_bd_addr_segs perceptron_18/s_axi/reg0]
assign_bd_address -offset 0x43D20000 -range 4K -target_address_space [get_bd_addr_spaces processing_system7_0/Data] [get_bd_addr_segs perceptron_19/s_axi/reg0]
assign_bd_address -offset 0x43D30000 -range 4K -target_address_space [get_bd_addr_spaces processing_system7_0/Data] [get_bd_addr_segs perceptron_20/s_axi/reg0]
assign_bd_address -offset 0x43D40000 -range 4K -target_address_space [get_bd_addr_spaces processing_system7_0/Data] [get_bd_addr_segs perceptron_21/s_axi/reg0]
assign_bd_address -offset 0x43D50000 -range 4K -target_address_space [get_bd_addr_spaces processing_system7_0/Data] [get_bd_addr_segs perceptron_22/s_axi/reg0]
assign_bd_address -offset 0x60000000 -range 512M -target_address_space [get_bd_addr_spaces processing_system7_0/Data] [get_bd_addr_segs axi4_lite_register_m_0/s_axil/reg0]

validate_bd_design
save_bd_design
